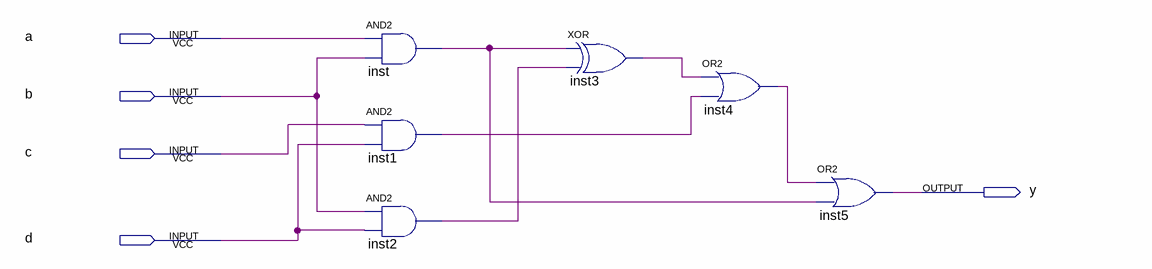
[diagram p0: schematic sheet]
// Quartus schematic Laba11.bdf as structural Verilog: 6 symbols, 5 pins
module Laba11 (
  input  a,
  input  b,
  input  c,
  input  d,
  output y
);

  wire inst1_out, inst2_out, inst3_out, inst4_out, inst_out;

  and inst (inst_out, a, b);
  and inst1 (inst1_out, c, d);
  and inst2 (inst2_out, b, d);
  xor inst3 (inst3_out, inst_out, inst2_out);
  or inst4 (inst4_out, inst3_out, inst1_out);
  or inst5 (y, inst4_out, inst_out);
endmodule
